# EAGLE schematic untitled (EAGLE 9.5.1)
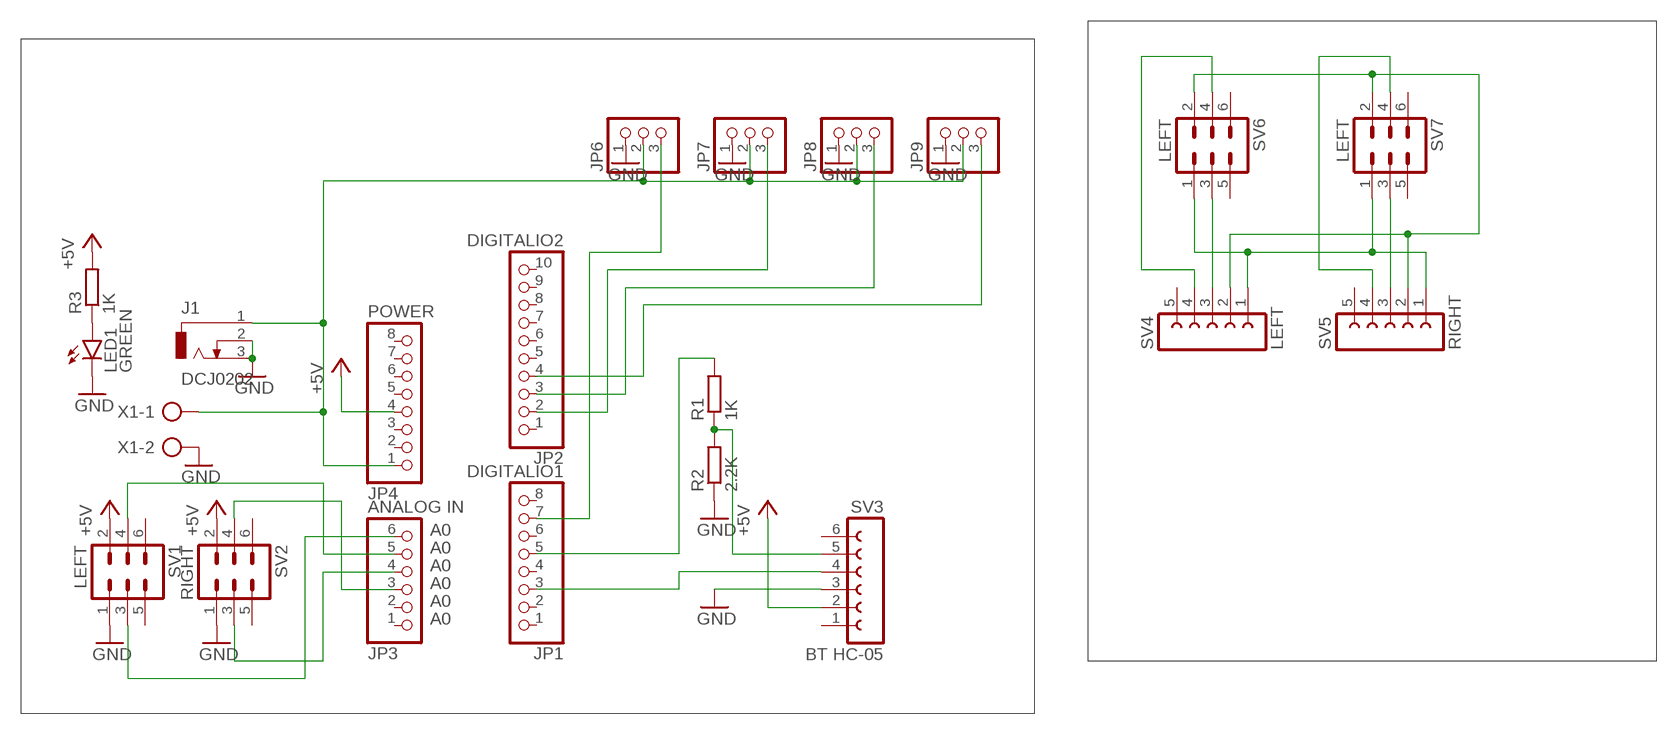
[diagram p0: schematic, sheet 1]

## Parts
J1  DCJ0202  [DCJ0202]
JP1  DIGITALIO1  PINHD-1X8  [1X08]
JP2  DIGITALIO2  PINHD-1X10  [1X10]
JP3  ANALOG IN  PINHD-1X6  [1X06]
JP4  POWER  PINHD-1X8  [1X08]
JP6  PINHD-1X3  [1X03]
JP7  PINHD-1X3  [1X03]
JP8  PINHD-1X3  [1X03]
JP9  PINHD-1X3  [1X03]
LED1  GREEN  LED3MM  [LED3MM]
R1  1K  R-EU_0207/10  [0207/10]
R2  2.2K  R-EU_0207/10  [0207/10]
R3  1K  R-EU_0207/10  [0207/10]
SV1  LEFT  ML6  [ML6]
SV2  RIGHT  ML6  [ML6]
SV3  BT HC-05  FE06W  [FE06W]
SV4  LEFT  FE05W  [FE05W]
SV5  RIGHT  FE05W  [FE05W]
SV6  LEFT  ML6  [ML6]
SV7  LEFT  ML6  [ML6]
X1  AK300/2  [AK300/2]

## Nets
+5V: JP4.4 R3.2 SV1.2 SV2.2 SV3.2
GND: J1.2 J1.3 JP6.1 JP7.1 JP8.1 JP9.1 LED1.K(C) R2.1 SV1.1 SV2.1 SV3.3 X1.2
N$1: JP1.3 SV3.4
N$2: J1.1 JP4.1 JP6.2 JP7.2 JP8.2 JP9.2 X1.1
N$3: R1.1 R2.2 SV3.5
N$4: JP1.5 R1.2
N$5: JP3.6 SV1.3
N$6: JP1.7 JP6.3
N$7: JP2.2 JP7.3
N$8: JP2.3 JP8.3
N$9: JP2.4 JP9.3
N$10: JP3.5 SV1.4
N$11: JP3.4 SV2.3
N$12: JP3.3 SV2.4
N$13: LED1.A R3.1
N$14: SV4.1 SV5.1 SV6.1 SV7.1
N$15: SV4.2 SV5.2 SV6.2 SV7.2
N$17: SV4.3 SV6.3
N$18: SV4.4 SV6.4
N$19: SV5.3 SV7.3
N$20: SV5.4 SV7.4
Unconnected: JP1.1 JP1.2 JP1.4 JP1.6 JP1.8 JP2.1 JP2.5 JP2.6 JP2.7 JP2.8 JP2.9 JP2.10 JP3.1 JP3.2 JP4.2 JP4.3 JP4.5 JP4.6 JP4.7 JP4.8 SV1.5 SV1.6 SV2.5 SV2.6 SV3.1 SV3.6 SV4.5 SV5.5 SV6.5 SV6.6 SV7.5 SV7.6

## Notes on the sheet
- A0
- A0
- A0
- A0
- A0
- A0

## Library data of the parts
J1 = con-jack:DCJ0202: DC POWER JACK Source: DCJ0202.pdf; OC_FARNELL: unknown; OC_NEWARK: unknown
JP1 JP4 = pinhead:PINHD-1X8: PIN HEADER
JP2 = pinhead:PINHD-1X10: PIN HEADER
JP3 = pinhead:PINHD-1X6: PIN HEADER
JP6-JP9 = pinhead:PINHD-1X3: PIN HEADER
LED1 = led:LED: LED OSRAM: - CHIPLED LG R971, LG N971, LY N971, LG Q971, LY Q971, LO R971, LY R971 LH N974, LH R974 LS Q976, LO Q976, LY Q976 LO Q996 - Hyper CHIPLED LW Q18S LB Q993, LB Q99A, LB R99A - SideLED LS A670, LO A670, LY A670, LG A670, LP A670 LB A673, LV A673, LT A673, LW A673 LH A674 LY A675 LS A676, LA A676, LO A676, LY A676, LW A676 LS A679, LY A679, LG A679 - Hyper Micro SIDELED® LS Y876, LA Y876, LO Y876, LY Y876 LT Y87S - SmartLED LW L88C, LW L88S LB L89C, LB L89S, LG L890 LS L89K, LO L89K, LY L89K LS L896, LA L896, LO L896, LY L896 - TOPLED LS T670, LO T670, LY T670, LG T670, LP T670 LSG T670, LSP T670, LSY T670, LOP T670, LYG T670 LG T671, LOG T671, LSG T671 LB T673, LV T673, LT T673, LW T673 LH T674 LS T676, LA T676, LO T676, LY T676, LB T676, LH T676, LSB T676, LW T676 LB T67C, LV T67C, LT T67C, LS T67K, LO T67K, LY T67K, LW E67C LS E67B, LA E67B, LO E67B, LY E67B, LB E67C, LV E67C, LT E67C LW T67C LS T679, LY T679, LG T679 LS T770, LO T770, LY T770, LG T770, LP T770 LB T773, LV T773, LT T773, LW T773 LH T774 LS E675, LA E675, LY E675, LS T675 LS T776, LA T776, LO T776, LY T776, LB T776 LHGB T686 LT T68C, LB T68C - Hyper Mini TOPLED® LB M676 - Mini TOPLED Santana® LG M470 LS M47K, LO M47K, LY M47K Source: http://www.osram.convergy.de LUXEON: - LUMILED® LXK2-PW12-R00, LXK2-PW12-S00, LXK2-PW14-U00, LXK2-PW14-V00 LXK2-PM12-R00, LXK2-PM12-S00, LXK2-PM14-U00 LXK2-PE12-Q00, LXK2-PE12-R00, LXK2-PE12-S00, LXK2-PE14-T00, LXK2-PE14-U00 LXK2-PB12-K00, LXK2-PB12-L00, LXK2-PB12-M00, LXK2-PB14-N00, LXK2-PB14-P00, LXK2-PB14-Q00 LXK2-PR12-L00, LXK2-PR12-M00, LXK2-PR14-Q00, LXK2-PR14-R00 LXK2-PD12-Q00, LXK2-PD12-R00, LXK2-PD12-S00 LXK2-PH12-R00, LXK2-PH12-S00 LXK2-PL12-P00, LXK2-PL12-Q00, LXK2-PL12-R00 Source: www.luxeon.com KINGBRIGHT: KA-3528ASYC Source: www.kingbright.com
R1-R3 = rcl:R-EU_: RESISTOR, European symbol; SPICEPREFIX: R
SV1 SV2 SV6 SV7 = con-harting-ml:ML6: HARTING; OC_FARNELL: unknown; OC_NEWARK: unknown
SV3 = con-lsta:FE06W: FEMALE HEADER; OC_FARNELL: unknown; OC_NEWARK: unknown
SV4 SV5 = con-lsta:FE05W: FEMALE HEADER; OC_FARNELL: unknown; OC_NEWARK: unknown
X1 = con-ptr500:AK300/2: CONNECTOR; OC_FARNELL: unknown; OC_NEWARK: unknown